# EAGLE schematic Aeternum_V1_0 (EAGLE 9.1.1)

## Sheet 1 of 5
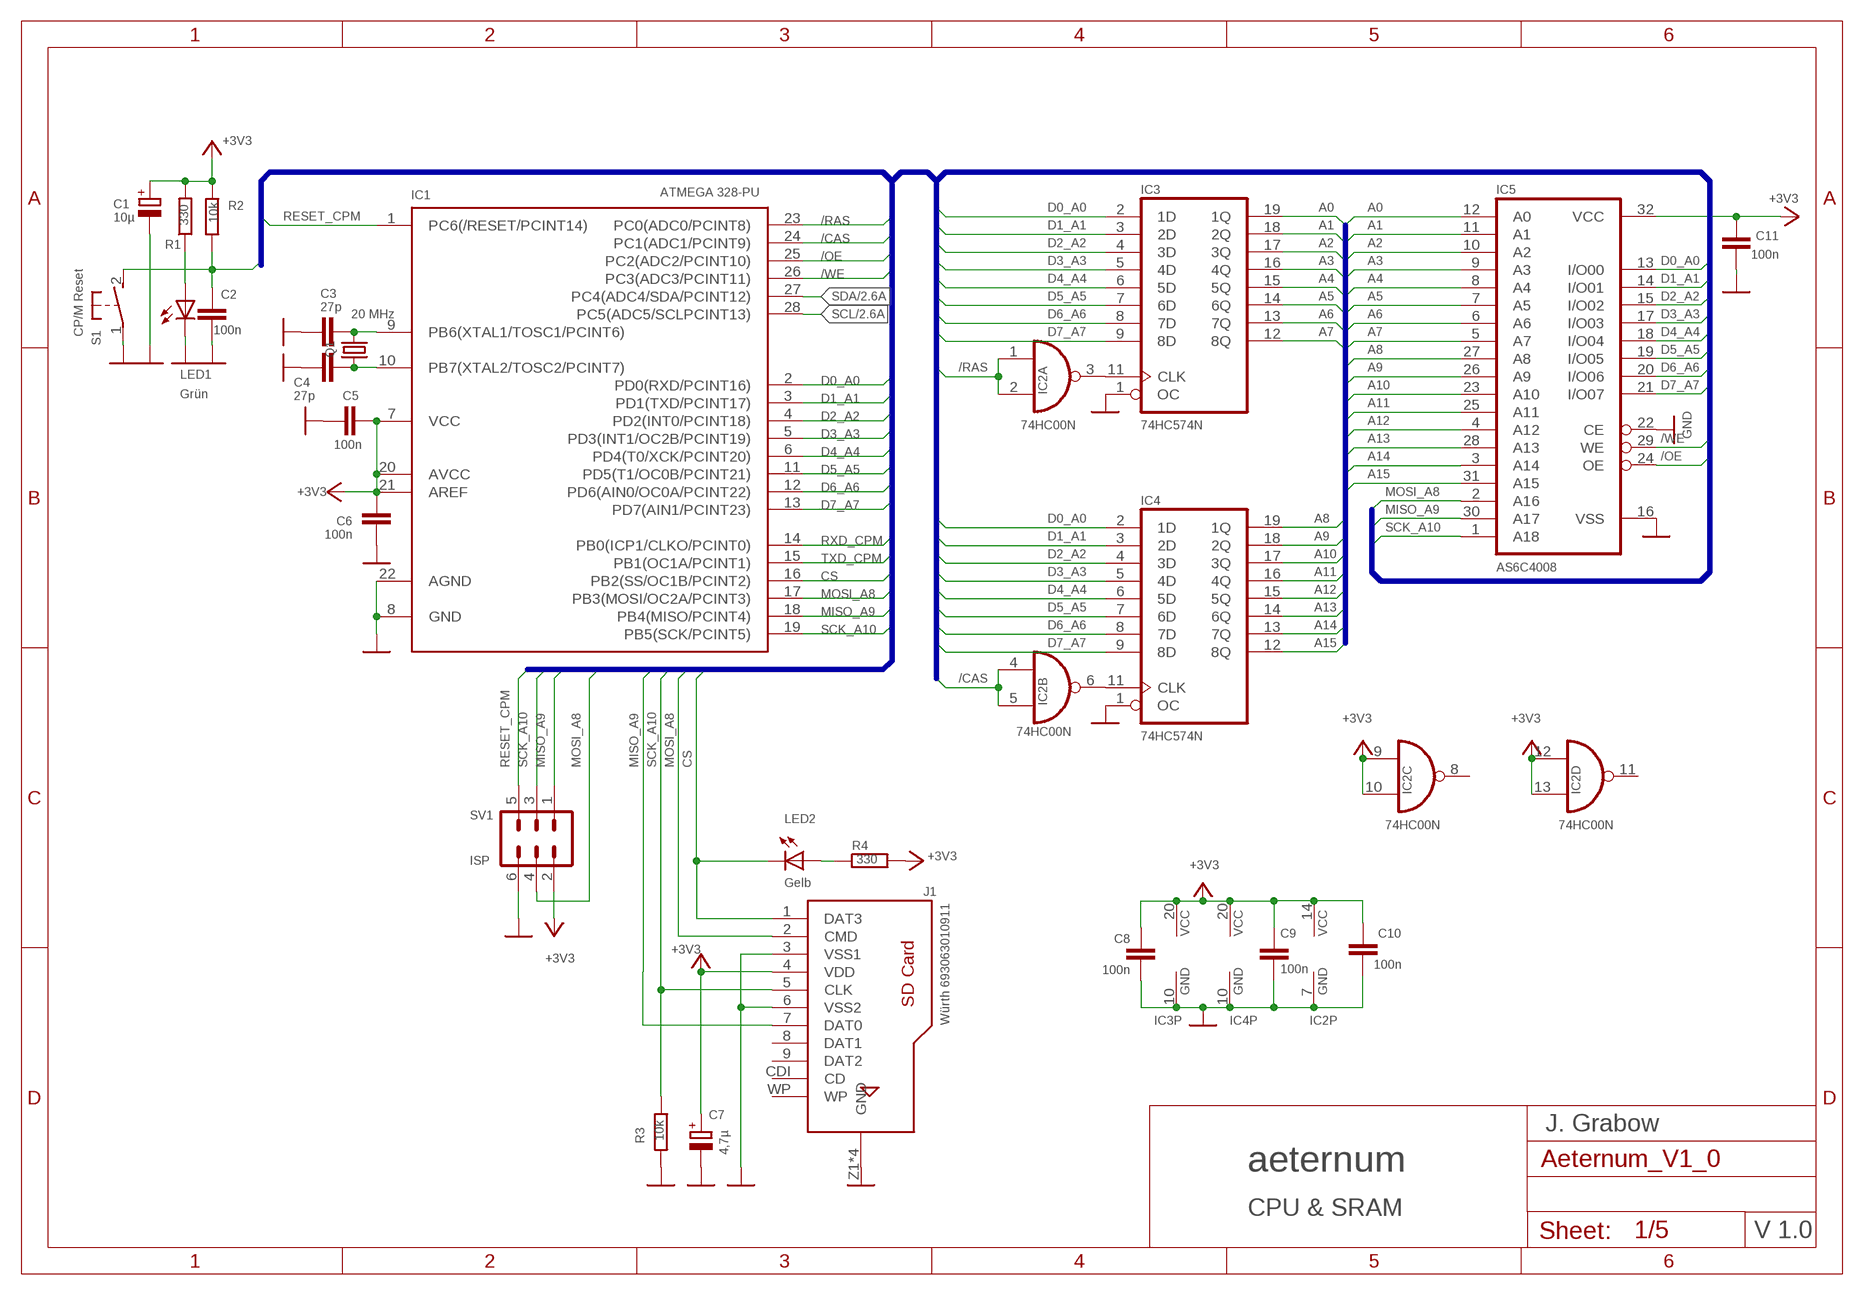
[diagram p0: schematic, sheet 1]

### Parts
C1  10µ  CPOL-EUE2-5  [E2-5]
C2  100n  C-EU025-024X044  [C025-024X044]
C3  27p  C-EU025-024X044  [C025-024X044]
C4  27p  C-EU025-024X044  [C025-024X044]
C5  100n  C-EU025-024X044  [C025-024X044]
C6  100n  C-EU025-024X044  [C025-024X044]
C7  4,7µ  CPOL-EUE2-5  [E2-5]
C8  100n  C-EU025-024X044  [C025-024X044]
C9  100n  C-EU025-024X044  [C025-024X044]
C10  100n  C-EU025-024X044  [C025-024X044]
C11  100n  C-EU025-024X044  [C025-024X044]
IC1  ATMEGA 328-PU  MEGA48/88/168-PU  [DIL28-3]
IC2  74HC00N  [DIL14]
IC3  74HC574N  [DIL20]
IC4  74HC574N  [DIL20]
IC5  AS6C4008  HM628512A_DIL32  [DIL32]
J1  Würth 693063010911  693063010911  [693063010911]
LED1  Grün  LEDCHIPLED_0603  [CHIPLED_0603]
LED2  Gelb  LEDCHIPLED_0603  [CHIPLED_0603]
Q1  20 MHz  CRYSTALHC49S  [HC49/S]
R1  330  R-EU_0204/2V  [0204V]
R2  10k  R-EU_0204/2V  [0204V]
R3  10k  R-EU_0204/2V  [0204V]
R4  330  R-EU_0204/2V  [0204V]
S1  CP/M Reset  31-XX  [B3F-31XX]
SV1  ISP  ML6  [ML6]

### Nets
+3V3: C1.+ C5.1 C6.2 C7.+ C8.1 C9.1 C10.1 C11.1 IC1.7(VCC) IC1.20(AVCC) IC1.21(AREF) IC2.9(C:I0) IC2.10(C:I1) IC2.12(D:I0) IC2.13(D:I1) IC2.14(P:VCC) IC3.20(VCC) IC4.20(VCC) IC5.32(VCC) J1.4(VDD) R1.2 R2.1 R4.2 SV1.2 ; also sheet 2,3,4,5
/CAS: IC1.24(PC1(ADC1/PCINT9)) IC2.4(B:I0) IC2.5(B:I1)
/OE: IC1.25(PC2(ADC2/PCINT10)) IC5.24(OE)
/RAS: IC1.23(PC0(ADC0/PCINT8)) IC2.1(A:I0) IC2.2(A:I1)
/WE: IC1.26(PC3(ADC3/PCINT11)) IC5.29(WE)
A0: IC3.19(1Q) IC5.12(A0)
A1: IC3.18(2Q) IC5.11(A1)
A2: IC3.17(3Q) IC5.10(A2)
A3: IC3.16(4Q) IC5.9(A3)
A4: IC3.15(5Q) IC5.8(A4)
A5: IC3.14(6Q) IC5.7(A5)
A6: IC3.13(7Q) IC5.6(A6)
A7: IC3.12(8Q) IC5.5(A7)
A8: IC4.19(1Q) IC5.27(A8)
A9: IC4.18(2Q) IC5.26(A9)
A10: IC4.17(3Q) IC5.23(A10)
A11: IC4.16(4Q) IC5.25(A11)
A12: IC4.15(5Q) IC5.4(A12)
A13: IC4.14(6Q) IC5.28(A13)
A14: IC4.13(7Q) IC5.3(A14)
A15: IC4.12(8Q) IC5.31(A15)
CS: IC1.16(PB2(SS/OC1B/PCINT2)) J1.1(DAT3) LED2.C
D0_A0: IC1.2(PD0(RXD/PCINT16)) IC3.2(1D) IC4.2(1D) IC5.13(I/O00)
D1_A1: IC1.3(PD1(TXD/PCINT17)) IC3.3(2D) IC4.3(2D) IC5.14(I/O01)
D2_A2: IC1.4(PD2(INT0/PCINT18)) IC3.4(3D) IC4.4(3D) IC5.15(I/O02)
D3_A3: IC1.5(PD3(INT1/OC2B/PCINT19)) IC3.5(4D) IC4.5(4D) IC5.17(I/O03)
D4_A4: IC1.6(PD4(T0/XCK/PCINT20)) IC3.6(5D) IC4.6(5D) IC5.18(I/O04)
D5_A5: IC1.11(PD5(T1/OC0B/PCINT21)) IC3.7(6D) IC4.7(6D) IC5.19(I/O05)
D6_A6: IC1.12(PD6(AIN0/OC0A/PCINT22)) IC3.8(7D) IC4.8(7D) IC5.20(I/O06)
D7_A7: IC1.13(PD7(AIN1/PCINT23)) IC3.9(8D) IC4.9(8D) IC5.21(I/O07)
GND: C1.- C2.1 C3.2 C4.2 C5.2 C6.1 C7.- C8.2 C9.2 C10.2 C11.2 IC1.8(GND) IC1.22(AGND) IC2.7(P:GND) IC3.1(OC) IC3.10(GND) IC4.1(OC) IC4.10(GND) IC5.16(VSS) IC5.22(CE) J1.3(VSS1) J1.6(VSS2) J1.Z1(GND) J1.Z2(GND) J1.Z3(GND) J1.Z4(GND) LED1.C R3.2 S1.1(P) SV1.6 ; also sheet 2,3,4,5
MISO_A9: IC1.18(PB4(MISO/PCINT4)) IC5.30(A17) J1.7(DAT0) SV1.1
MOSI_A8: IC1.17(PB3(MOSI/OC2A/PCINT3)) IC5.2(A16) J1.2(CMD) SV1.4
N$1: C4.1 IC1.10(PB7(XTAL2/TOSC2/PCINT7)) Q1.1
N$5: IC2.3(A:O) IC3.11(CLK)
N$7: LED1.A R1.1
N$13: LED2.A R4.1
N$24: C3.1 IC1.9(PB6(XTAL1/TOSC1/PCINT6)) Q1.2
N$40: IC2.6(B:O) IC4.11(CLK)
RESET_CPM: C2.2 IC1.1(PC6(/RESET/PCINT14)) R2.2 S1.2(S) SV1.5 ; also sheet 5
RXD_CPM: IC1.14(PB0(ICP1/CLKO/PCINT0)) ; also sheet 4
SCK_A10: IC1.19(PB5(SCK/PCINT5)) IC5.1(A18) J1.5(CLK) R3.1 SV1.3
SCL: IC1.28(PC5(ADC5/SCLPCINT13)) ; also sheet 2,3
SDA: IC1.27(PC4(ADC4/SDA/PCINT12)) ; also sheet 2,3
TXD_CPM: IC1.15(PB1(OC1A/PCINT1)) ; also sheet 4
Unconnected: IC2.8(C:O) IC2.11(D:O) J1.8(DAT1) J1.9(DAT2) J1.CDI(CD) J1.WP

### Buses
/CAS,CS,D0_A0,D1_A1,D2_A2,D3_A3,D4_A4,D5_A5,D6_A6,D7_A7,MISO_A9,MOSI_A8,/OE,/RAS,RESET_CPM,RXD,SCK,SCK_A10,TXD,/WE
A0,A1,A2,A3,A4,A5,A6,A7,A8,A9,A10,A11,A12,A13,A14,A15
/CAS,CS,D0_A0,D1_A1,D2_A2,D3_A3,D4_A4,D5_A5,D6_A6,D7_A7,MISO_A9,MOSI_A8,/OE,/RAS,RESET_CPM,RXD_AVR,RXD_CPM,SCK,SCK_A10,TXD_AVR,TXD_CPM,/WE

### Notes on the sheet
- J. Grabow
- aeternum
- CPU & SRAM
- V 1.0

## Sheet 2 of 5
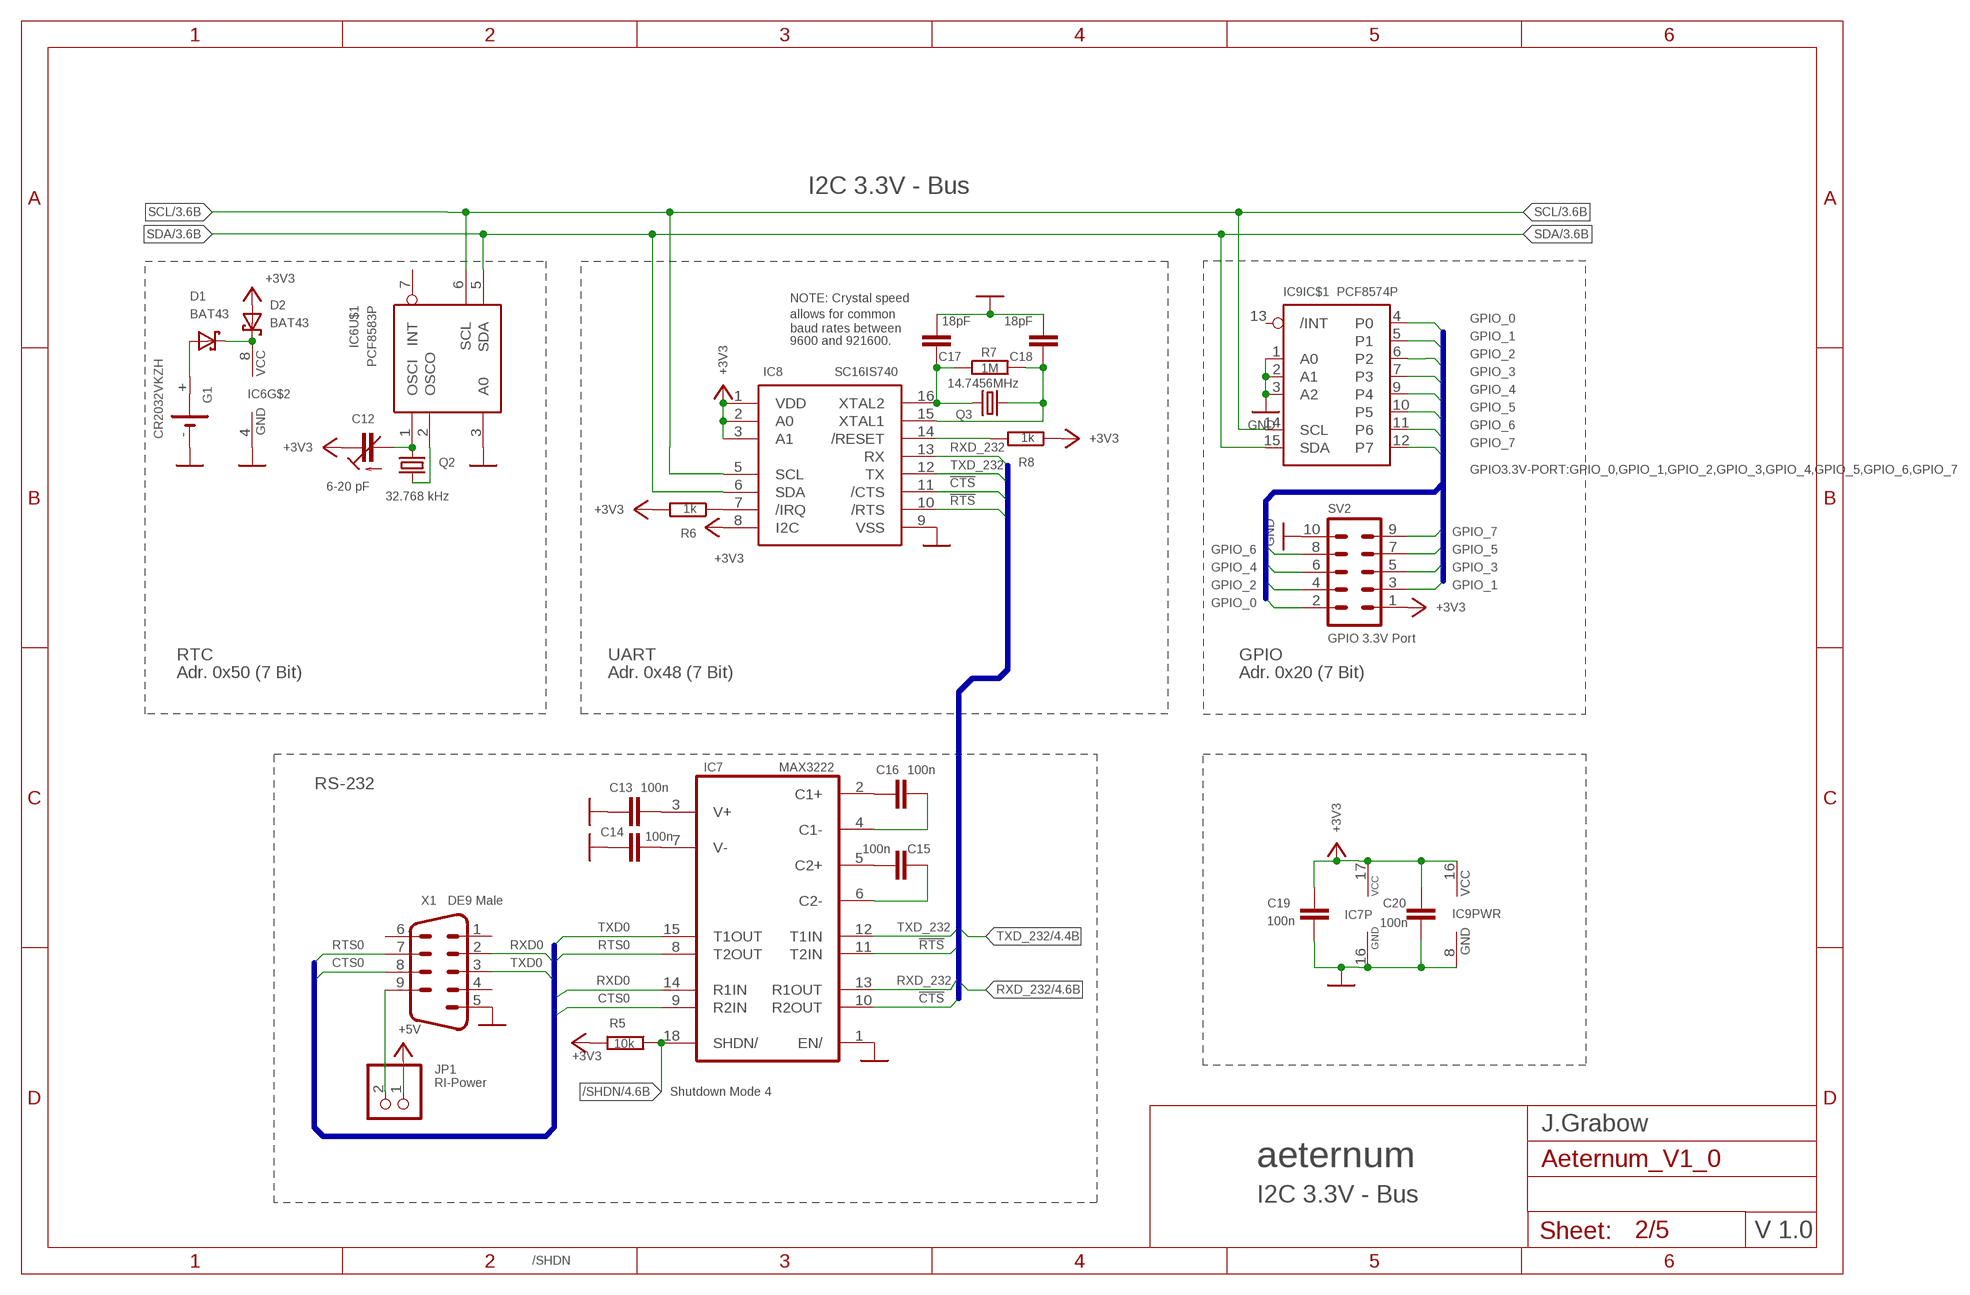
[diagram p1: schematic, sheet 2]

### Parts
C12  6-20 pF  C-TRIMMTZ03  [CTRIMTZ03]
C13  100n  C-EU025-024X044  [C025-024X044]
C14  100n  C-EU025-024X044  [C025-024X044]
C15  100n  C-EU025-024X044  [C025-024X044]
C16  100n  C-EU025-024X044  [C025-024X044]
C17  18pF  CAP0402-CAP  [0402-CAP]
C18  18pF  CAP0402-CAP  [0402-CAP]
C19  100n  C-EU025-024X044  [C025-024X044]
C20  100n  C-EU025-024X044  [C025-024X044]
D1  BAT43  DS_E2L  [E2LINE]
D2  BAT43  DS_E2L  [E2LINE]
G1  CR2032VKZH  [KZH20PCB-V]
IC6  PCF8583P  [DIL08]
IC7  MAX3222  [DIL18]
IC8  SC16IS740  RICKK2_SC16IS740  [RICKK2_SC16IS740]
IC9  PCF8574P  [DIL16]
JP1  RI-Power  PINHD-1X2  [1X02]
Q2  32.768 kHz  CRYSTALTC26H  [TC26H]
Q3  14.7456MHz  CRYSTAL5X3  [CRYSTAL-SMD-5X3]
R5  10k  R-EU_0204/2V  [0204V]
R6  1k  R-EU_R0805  [R0805]
R7  1M  R-EU_R0805  [R0805]
R8  1k  R-EU_R0805  [R0805]
SV2  GPIO 3.3V Port  ML10L  [ML10L]
X1  DE9 Male  M09HP  [M09HP]

### Nets
!CTS: IC7.10(R2OUT) IC8.11(/CTS)
!RTS: IC7.11(T2IN) IC8.10(/RTS)
+3V3: C12.1(E) C19.2 C20.2 D2.2(A) IC7.17(VCC) IC8.1(VDD) IC8.2(A0) IC8.3(A1) IC8.8(I2C) IC9.16(PWR:VCC) R5.2 R6.2 R8.1 SV2.1 ; also sheet 1,3,4,5
+5V: JP1.1 ; also sheet 3,4,5
/SHDN: IC7.18(SHDN/) R5.1 ; also sheet 4
CTS0: IC7.9(R2IN) X1.8
GND: C13.2 C14.2 C17.2 C18.2 C19.1 C20.1 G1.- IC6.3(U$1:A0) IC6.4(GND) IC7.1(EN/) IC7.16(GND) IC8.9(VSS) IC9.1(IC$1:A0) IC9.2(IC$1:A1) IC9.3(IC$1:A2) IC9.8(PWR:GND) SV2.10 X1.5 ; also sheet 1,3,4,5
GPIO_0: IC9.4(IC$1:P0) SV2.2
GPIO_1: IC9.5(IC$1:P1) SV2.3
GPIO_2: IC9.6(IC$1:P2) SV2.4
GPIO_3: IC9.7(IC$1:P3) SV2.5
GPIO_4: IC9.9(IC$1:P4) SV2.6
GPIO_5: IC9.10(IC$1:P5) SV2.7
GPIO_6: IC9.11(IC$1:P6) SV2.8
GPIO_7: IC9.12(IC$1:P7) SV2.9
N$2: C12.2(A) IC6.1(U$1:OSCI) Q2.1
N$4: IC6.2(U$1:OSCO) Q2.2
N$8: C17.1 IC8.16(XTAL2) Q3.3 R7.1
N$9: C16.2 IC7.2(C1+)
N$10: JP1.2 X1.9
N$11: C15.1 IC7.5(C2+)
N$12: C14.1 IC7.7(V-)
N$14: C16.1 IC7.4(C1-)
N$15: C15.2 IC7.6(C2-)
N$17: C13.1 IC7.3(V+)
N$18: D1.1(K) D2.1(K) IC6.8(VCC)
N$19: D1.2(A) G1.+
N$23: C18.1 IC8.15(XTAL1) Q3.1 R7.2
N$49: IC8.14(/RESET) R8.2
N$50: IC8.7(/IRQ) R6.1
RTS0: IC7.8(T2OUT) X1.7
RXD0: IC7.14(R1IN) X1.2
RXD_232: IC7.13(R1OUT) IC8.13(RX) ; also sheet 4
SCL: IC6.6(U$1:SCL) IC8.5(SCL) IC9.14(IC$1:SCL) ; also sheet 1,3
SDA: IC6.5(U$1:SDA) IC8.6(SDA) IC9.15(IC$1:SDA) ; also sheet 1,3
TXD0: IC7.15(T1OUT) X1.3
TXD_232: IC7.12(T1IN) IC8.12(TX) ; also sheet 4
Unconnected: G1.+@1(+) IC6.7(U$1:INT) IC9.13(IC$1:/INT) X1.1 X1.4 X1.6

### Buses
UART:!CTS,!DCD,!DSR,!DTR,!RI,!RTS,RXD_232,TXD_232
GPIO3.3V-PORT:GPIO_0,GPIO_1,GPIO_2,GPIO_3,GPIO_4,GPIO_5,GPIO_6,GPIO_7
CTS0,DCD0,DSR0,DTR0,GND,RI0,RS-232,RTS0,RXD0,TXA0,TXD0,VCC

### Notes on the sheet
- I2C 3.3V - Bus
- NOTE: Crystal speed
- allows for common
- baud rates between
- 9600 and 921600.
- RTC | UART | GPIO
- Adr. 0x50 (7 Bit) | Adr. 0x48 (7 Bit) | Adr. 0x20 (7 Bit)
- RS-232
- Shutdown Mode 4
- J.Grabow
- aeternum
- I2C 3.3V - Bus
- V 1.0

## Sheet 3 of 5
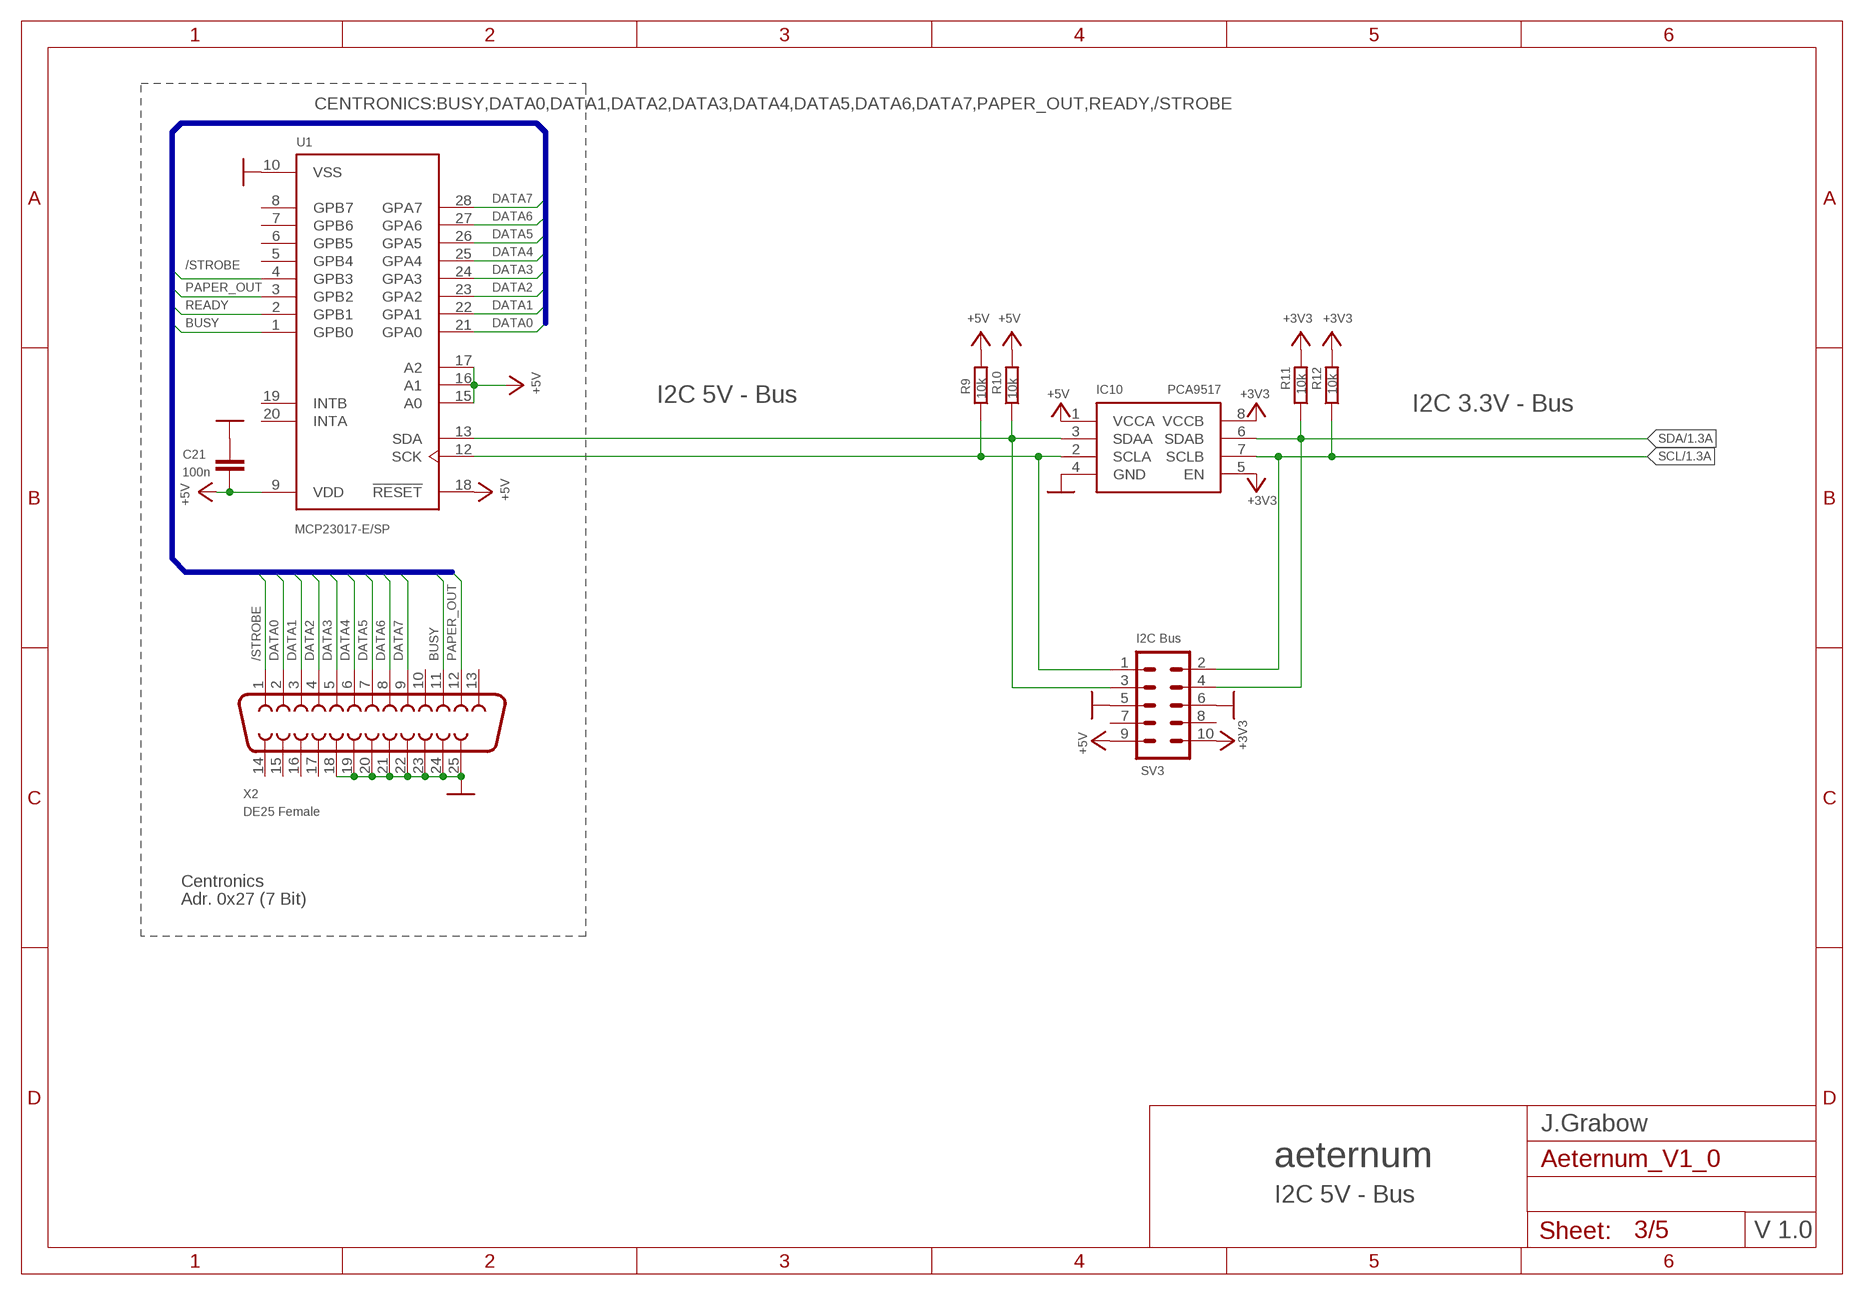
[diagram p2: schematic, sheet 3]

### Parts
C21  100n  C-EUC0805  [C0805]
IC10  PCA9517  [SO-08]
R9  10k  R-EU_0207/2V  [0207/2V]
R10  10k  R-EU_0207/2V  [0207/2V]
R11  10k  R-EU_0207/2V  [0207/2V]
R12  10k  R-EU_0207/2V  [0207/2V]
SV3  I2C Bus  ML10L  [ML10L]
U1  MCP23017-E/SP  [DIP793W45P254L3556H508Q28]
X2  DE25 Female  F25H  [F25H]

### Nets
+3V3: IC10.5(EN) IC10.8(VCCB) R11.2 R12.2 SV3.10 ; also sheet 1,2,4,5
+5V: C21.1 IC10.1(VCCA) R9.2 R10.2 SV3.9 U1.9(VDD) U1.15(A0) U1.16(A1) U1.17(A2) U1.18(!RESET) ; also sheet 2,4,5
/STROBE: U1.4(GPB3) X2.1
BUSY: U1.1(GPB0) X2.11
DATA0: U1.21(GPA0) X2.2
DATA1: U1.22(GPA1) X2.3
DATA2: U1.23(GPA2) X2.4
DATA3: U1.24(GPA3) X2.5
DATA4: U1.25(GPA4) X2.6
DATA5: U1.26(GPA5) X2.7
DATA6: U1.27(GPA6) X2.8
DATA7: U1.28(GPA7) X2.9
GND: C21.2 IC10.4(GND) SV3.5 SV3.6 U1.10(VSS) X2.18 X2.19 X2.20 X2.21 X2.22 X2.23 X2.24 X2.25 ; also sheet 1,2,4,5
PAPER_OUT: U1.3(GPB2) X2.12
READY: U1.2(GPB1)
SCL: IC10.7(SCLB) R12.1 SV3.2 ; also sheet 1,2
SCLA: IC10.2(SCLA) R9.1 SV3.1 U1.12(SCK)
SDA: IC10.6(SDAB) R11.1 SV3.4 ; also sheet 1,2
SDAA: IC10.3(SDAA) R10.1 SV3.3 U1.13(SDA)
Unconnected: SV3.7 SV3.8 U1.5(GPB4) U1.6(GPB5) U1.7(GPB6) U1.8(GPB7) U1.19(INTB) U1.20(INTA) X2.10 X2.13 X2.14 X2.15 X2.16 X2.17

### Buses
CENTRONICS:BUSY,DATA0,DATA1,DATA2,DATA3,DATA4,DATA5,DATA6,DATA7,PAPER_OUT,READY,/STROBE

### Notes on the sheet
- I2C 5V - Bus
- I2C 3.3V - Bus
- Centronics
- Adr. 0x27 (7 Bit)
- J.Grabow
- aeternum
- I2C 5V - Bus
- V 1.0

## Sheet 4 of 5
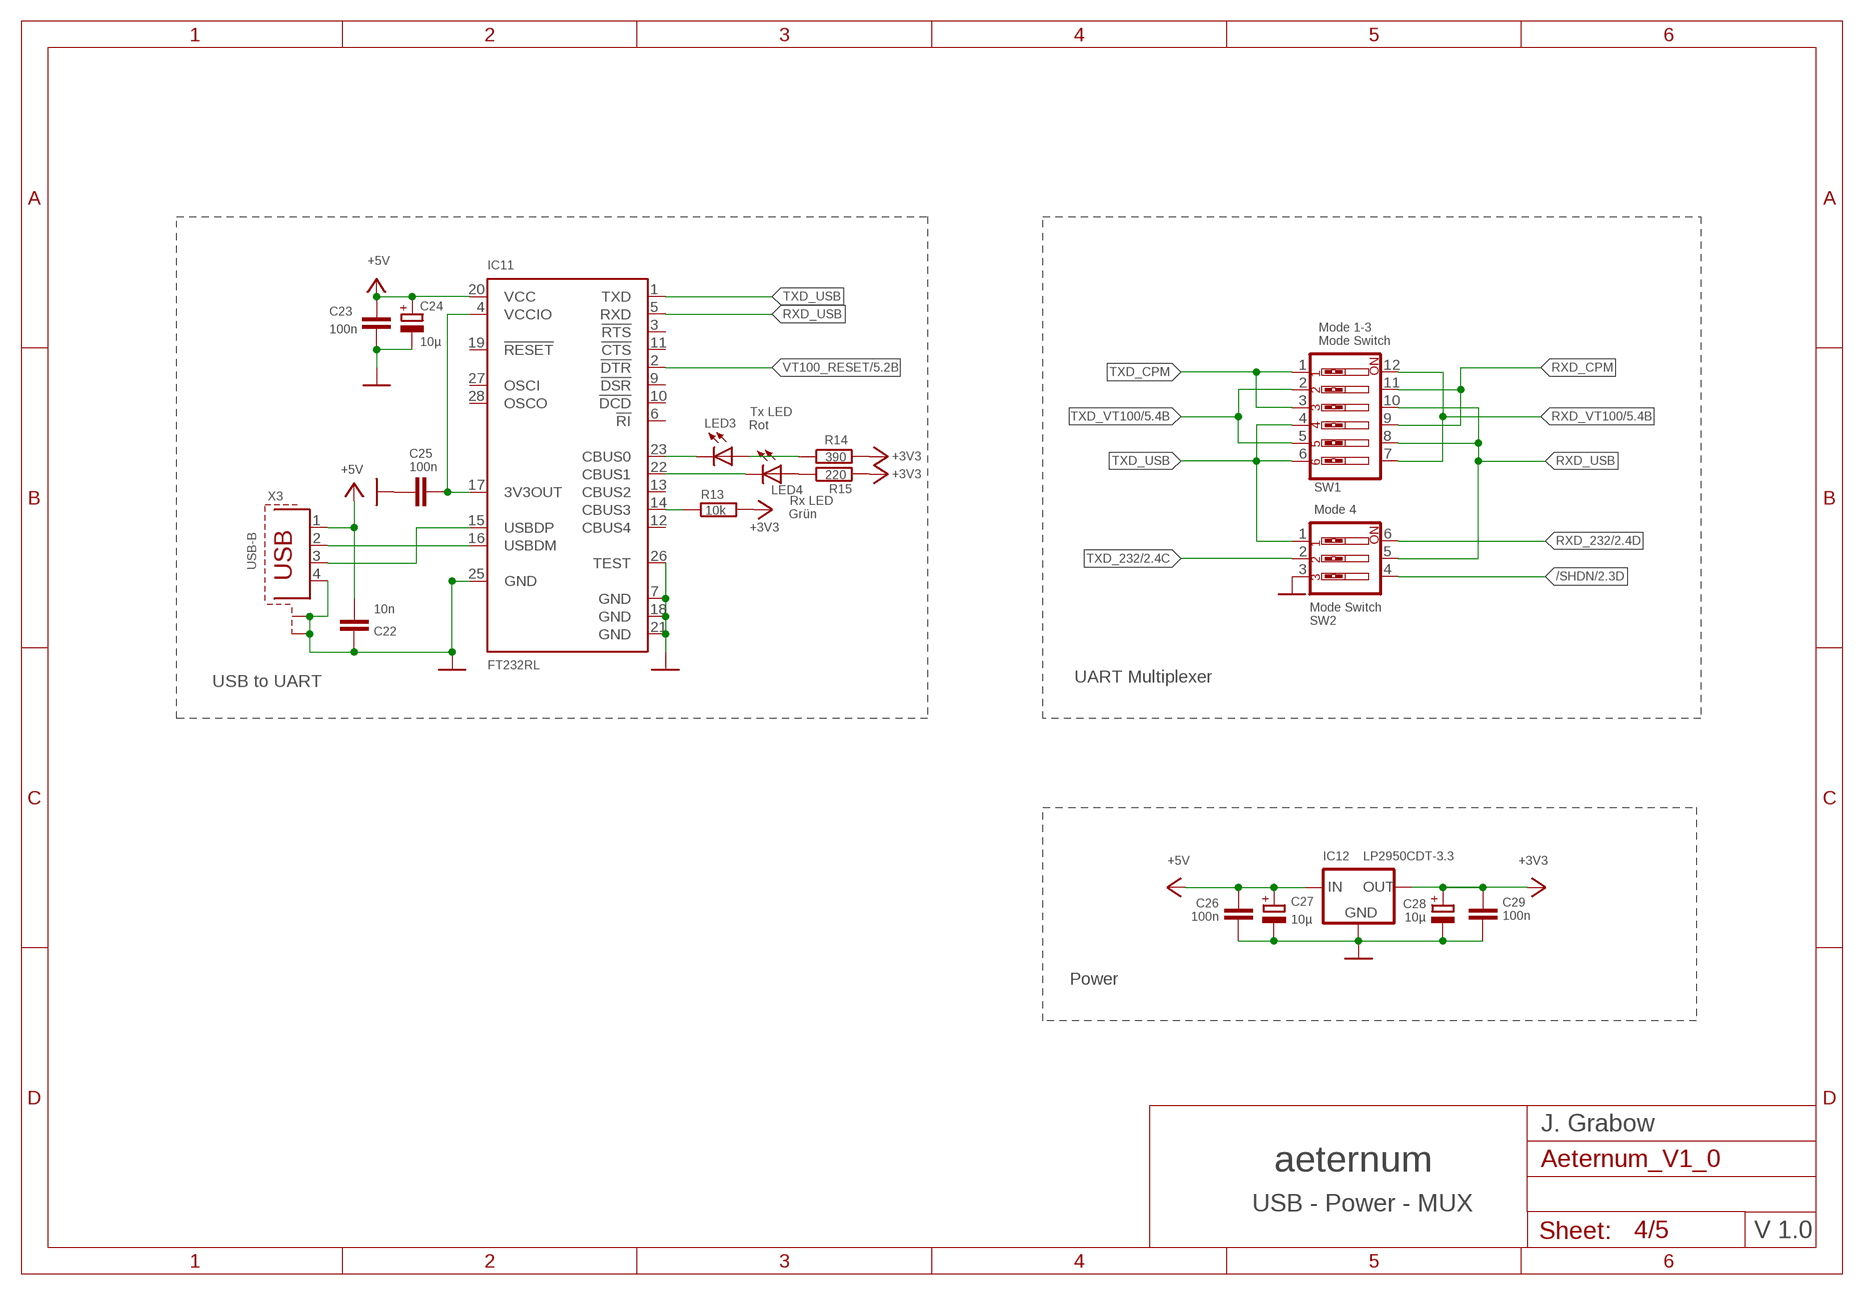
[diagram p3: schematic, sheet 4]

### Parts
C22  10n  C-EU025-024X044  [C025-024X044]
C23  100n  C-EU025-024X044  [C025-024X044]
C24  10µ  CPOL-EUE2-5  [E2-5]
C25  100n  C-EU025-024X044  [C025-024X044]
C26  100n  C-EU025-024X044  [C025-024X044]
C27  10µ  CPOL-EUE2-5  [E2-5]
C28  10µ  CPOL-EUE2-5  [E2-5]
C29  100n  C-EU025-024X044  [C025-024X044]
IC11  FT232RL  [SSOP28]
IC12  LP2950CDT-3.3  [DPACK]
LED3  Rot  LEDCHIPLED_0603  [CHIPLED_0603]
LED4  Grün  LEDCHIPLED_0603  [CHIPLED_0603]
R13  10k  R-EU_0204/2V  [0204V]
R14  390  R-EU_0204/2V  [0204V]
R15  220  R-EU_0204/2V  [0204V]
SW1  Mode Switch  SW_DIP-6  [EDG-06]
SW2  Mode Switch  SW_DIP-3  [EDG-03]
X3  USB-B  PN61729-S  [PN61729-S]

### Nets
+3V3: C28.+ C29.2 IC12.3(OUT) R13.2 R14.2 R15.2 ; also sheet 1,2,3,5
+5V: C22.2 C23.2 C24.+ C26.2 C27.+ IC11.20(VCC) IC12.1(IN) X3.1 ; supply symbol labelled 5V USB ; also sheet 2,3,5
/SHDN: SW2.4 ; also sheet 2
GND: C22.1 C23.1 C24.- C25.1 C26.1 C27.- C28.- C29.1 IC11.7(GND) IC11.18(GND) IC11.21(GND) IC11.25(GND) IC11.26(TEST) IC12.4(GND) SW2.3 X3.4 X3.S1 X3.S2 ; also sheet 1,2,3,5
N$3: IC11.16(USBDM) X3.2
N$6: IC11.15(USBDP) X3.3
N$16: IC11.14(CBUS3) R13.1
N$32: C25.2 IC11.4(VCCIO) IC11.17(3V3OUT)
N$43: IC11.23(CBUS0) LED3.C
N$44: IC11.22(CBUS1) LED4.C
N$45: LED4.A R15.1
N$46: LED3.A R14.1
RXD_232: SW2.6 ; also sheet 2
RXD_CPM: SW1.9 SW1.11 ; also sheet 1
RXD_USB: IC11.5(RXD) SW1.8 SW1.10 SW2.5
RXD_VT100: SW1.7 SW1.12 ; also sheet 5
TXD_232: SW2.2 ; also sheet 2
TXD_CPM: SW1.1 SW1.3 ; also sheet 1
TXD_USB: IC11.1(TXD) SW1.4 SW1.6 SW2.1
TXD_VT100: SW1.2 SW1.5 ; also sheet 5
VT100_RESET: IC11.2(!DTR) ; also sheet 5
Unconnected: IC11.3(!RTS) IC11.6(!RI) IC11.9(!DSR) IC11.10(!DCD) IC11.11(!CTS) IC11.12(CBUS4) IC11.13(CBUS2) IC11.19(!RESET) IC11.27(OSCI) IC11.28(OSCO)

### Notes on the sheet
- Mode 1-3
- Tx LED
- Rx LED
- Mode 4
- USB to UART | UART Multiplexer
- Power
- J. Grabow
- aeternum
- USB - Power - MUX
- V 1.0

## Sheet 5 of 5
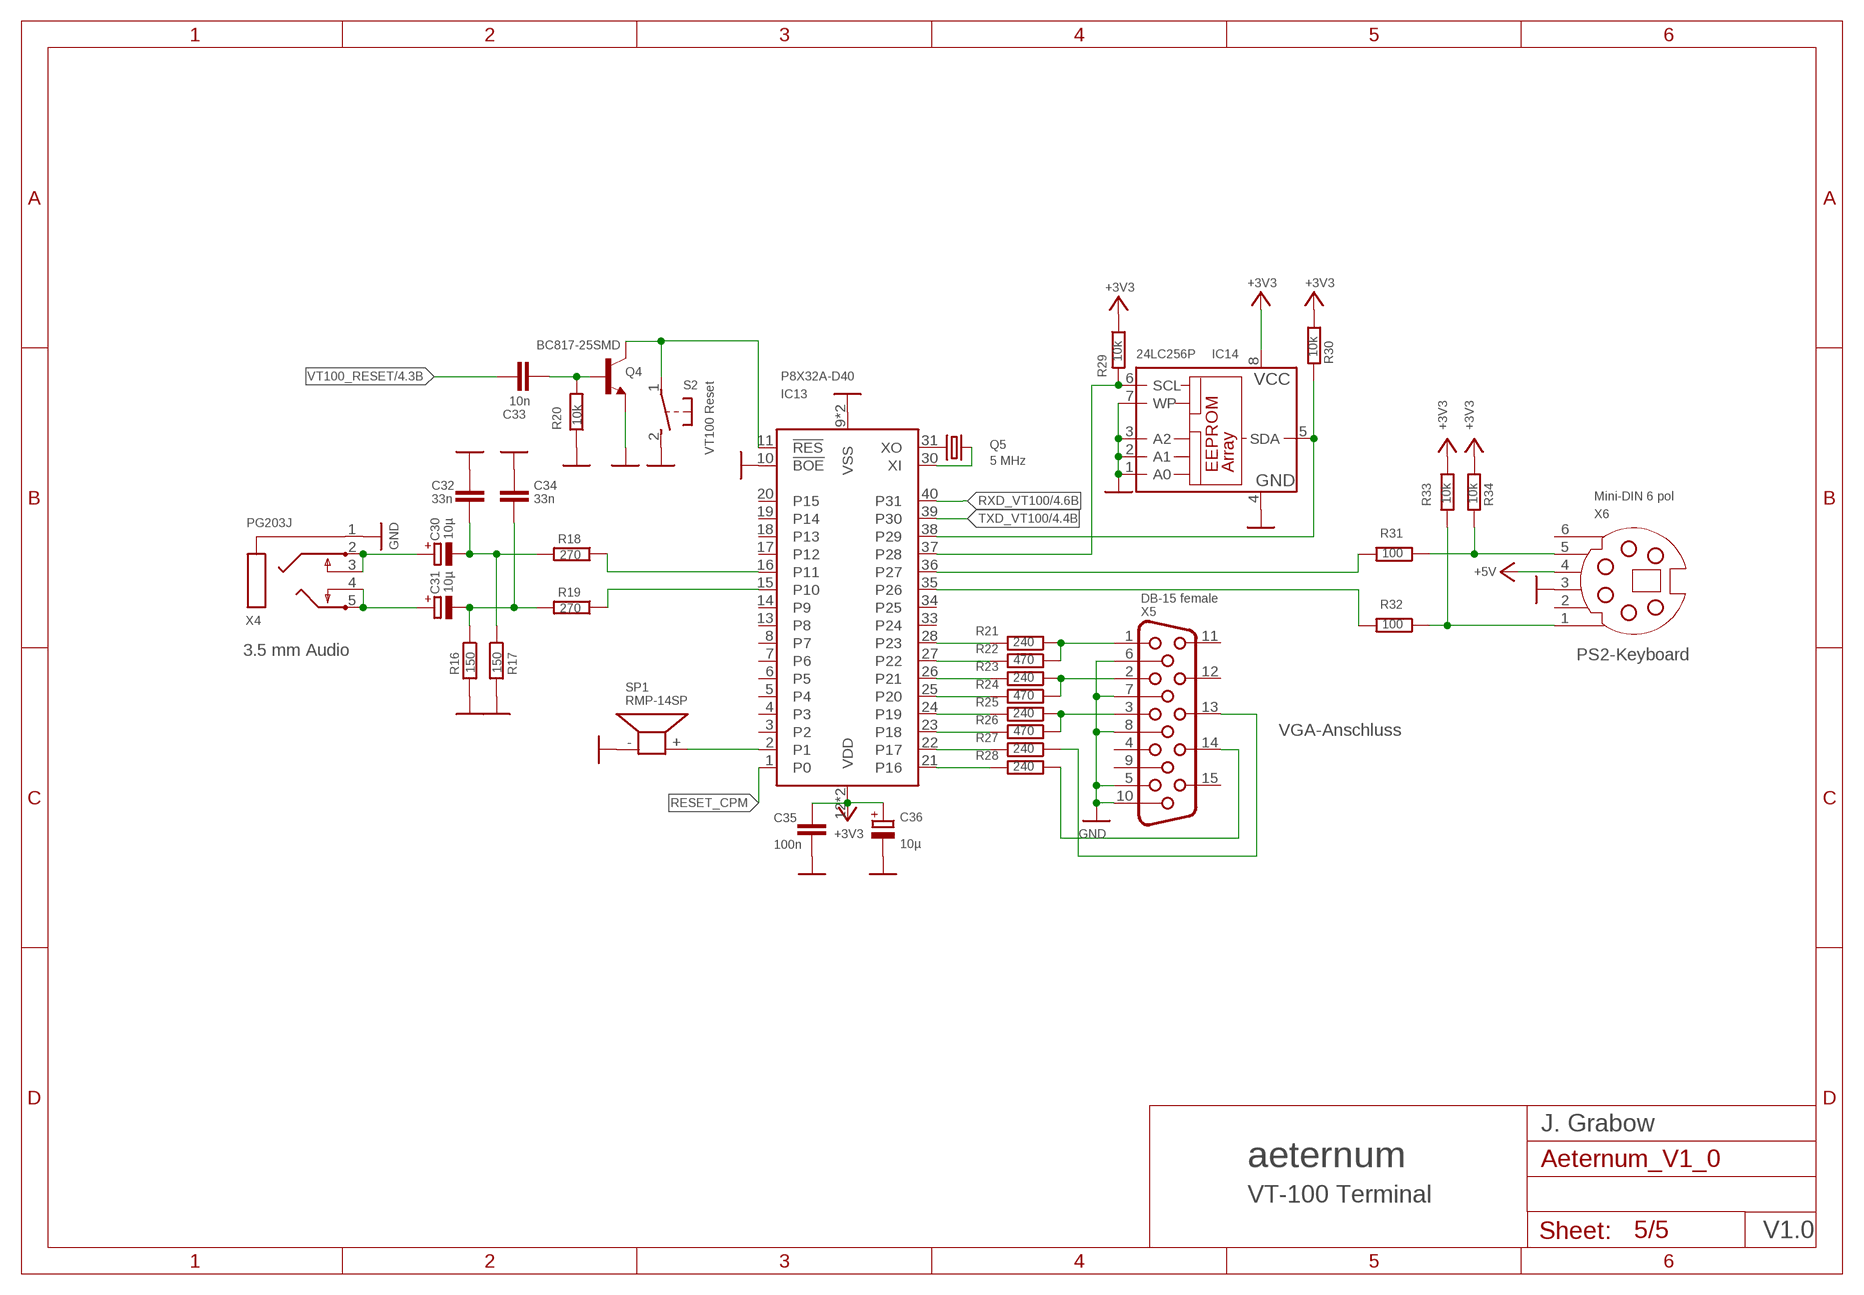
[diagram p4: schematic, sheet 5]

### Parts
C30  10µ  CPOL-EUE2.5-5  [E2,5-5]
C31  10µ  CPOL-EUE2.5-5  [E2,5-5]
C32  33n  C-EU025-024X044  [C025-024X044]
C33  10n  C-EU025-024X044  [C025-024X044]
C34  33n  C-EU025-024X044  [C025-024X044]
C35  100n  C-EU025-024X044  [C025-024X044]
C36  10µ  CPOL-EUE2,5-6E  [E2,5-6E]
IC13  P8X32A-D40  [DIL40]
IC14  24LC256P  [DIL8]
Q4  BC817-25SMD  [SOT23-BEC]
Q5  5 MHz  CRYSTALHC49S  [HC49/S]
R16  150  R-EU_0204/2V  [0204V]
R17  150  R-EU_0204/2V  [0204V]
R18  270  R-EU_0204/2V  [0204V]
R19  270  R-EU_0204/2V  [0204V]
R20  10k  R-EU_0204/2V  [0204V]
R21  240  R-EU_0204/2V  [0204V]
R22  470  R-EU_0204/2V  [0204V]
R23  240  R-EU_0204/2V  [0204V]
R24  470  R-EU_0204/2V  [0204V]
R25  240  R-EU_0204/2V  [0204V]
R26  470  R-EU_0204/2V  [0204V]
R27  240  R-EU_0204/2V  [0204V]
R28  240  R-EU_0204/2V  [0204V]
R29  10k  R-EU_0204/7  [0204/7]
R30  10k  R-EU_0204/7  [0204/7]
R31  100  R-EU_0204/2V  [0204V]
R32  100  R-EU_0204/2V  [0204V]
R33  10k  R-EU_0204/2V  [0204V]
R34  10k  R-EU_0204/2V  [0204V]
S2  VT100 Reset  31-XX  [B3F-31XX]
SP1  RMP-14SP  KSS1201  [KSS1201]
X4  PG203J  [PG203J]
X5  DB-15 female  HF15H  [HDF15H]
X6  Mini-DIN 6 pol  MDSSV-BC06  [SSV-BC06]

### Nets
+3V3: C35.2 C36.+ IC13.12(VDD) IC13.32(VDD) IC14.8(VCC) R29.1 R30.1 R33.1 R34.1 ; also sheet 1,2,3,4
+5V: X6.4 ; also sheet 2,3,4
GND: C32.2 C34.2 C35.1 C36.- IC13.9(VSS) IC13.10(!BOE) IC13.29(VSS) IC14.1(A0) IC14.2(A1) IC14.3(A2) IC14.4(GND) IC14.7(WP) Q4.E R16.2 R17.2 R20.1 S2.2(S) SP1.- X4.1 X5.5 X5.6 X5.7 X5.8 X5.10 X6.3 ; also sheet 1,2,3,4
N$20: IC13.30(XI) Q5.1
N$21: R21.1 R22.1 X5.1
N$22: IC13.28(P23) R21.2
N$25: IC13.27(P22) R22.2
N$26: R23.1 R24.1 X5.2
N$27: IC13.26(P21) R23.2
N$28: IC13.25(P20) R24.2
N$29: R25.1 R26.1 X5.3
N$30: IC13.24(P19) R25.2
N$31: IC13.23(P18) R26.2
N$33: IC13.22(P17) R27.2
N$34: IC13.21(P16) R28.2
N$35: R27.1 X5.13
N$36: R28.1 X5.14
N$37: R32.1 R33.2 X6.1
N$38: R31.1 R34.2 X6.5
N$39: IC13.31(XO) Q5.2
N$41: IC13.2(P1) SP1.+
N$42: C33.2 Q4.B R20.2
N$47: IC13.37(P28) IC14.6(SCL) R29.2
N$48: IC13.38(P29) IC14.5(SDA) R30.2
N$62: C31.- C34.1 R16.1 R19.2
N$63: C30.- C32.1 R17.1 R18.2
N$64: C30.+ X4.2 X4.3
N$65: C31.+ X4.4 X4.5
P10: IC13.16(P11) R18.1
P11: IC13.15(P10) R19.1
P26: IC13.35(P26) R32.2
P27: IC13.36(P27) R31.2
PROP_RESET: IC13.11(!RES) Q4.C S2.1(P)
RESET_CPM: IC13.1(P0) ; also sheet 1
RXD_VT100: IC13.40(P31) ; also sheet 4
TXD_VT100: IC13.39(P30) ; also sheet 4
VT100_RESET: C33.1 ; also sheet 4
Unconnected: IC13.3(P2) IC13.4(P3) IC13.5(P4) IC13.6(P5) IC13.7(P6) IC13.8(P7) IC13.13(P8) IC13.14(P9) IC13.17(P12) IC13.18(P13) IC13.19(P14) IC13.20(P15) IC13.33(P24) IC13.34(P25) X5.4 X5.9 X5.11 X5.12 X5.15 X6.2 X6.6

### Notes on the sheet
- 3.5 mm Audio | PS2-Keyboard
- VGA-Anschluss
- J. Grabow
- aeternum
- VT-100 Terminal
- V1.0

## Library data of the parts
C1 C7 C24 C27 C28 C30 C31 C36 = rcl:CPOL-EU: POLARIZED CAPACITOR, European symbol
C2-C6 C8-C11 C13-C16 C19-C23 C25 C26 C29 C32-C35 = rcl:C-EU: CAPACITOR, European symbol
C12 = rcl:C-TRIMM: Trimm capacitor
C17 C18 = SparkFun:CAP: Capacitor Standard 0603 ceramic capacitor, and 0.1" leaded capacitor.
D1 D2 = zetex:DS_E2L: SHOTTKY DIODE; OC_FARNELL: unknown; OC_NEWARK: unknown
G1 = battery:CR2032V: LI BATTERY Varta
IC1 = avr-7:MEGA48/88/168-PU
IC2 = 74xx-eu:74*00: Quad 2-input NAND gate
IC3 IC4 = 74xx-eu:74*574: 8-bit D type FLIP FLOP bus driver
IC5 = hitachi_sram_hm628512a-series_rev1:HM628512A_DIL32: 4M SRAM 512kword x 8bit
IC6 = i2c_new:PCF8583: Clock/calendar with 240 x 8-bit RAM
IC7 = maxim:MAX3222: RS232 TRANSCEIVER; MPN: MAX3222EPN+; OC_FARNELL: 1188044; OC_NEWARK: 99K3237
IC8 = SC16IS740v4:RICKK2_SC16IS740
IC9 = i2c_new:PCF8574: Remote 8-Bit I/O Expander for I²C Bus
IC10 = PCA9517:PCA9517
IC11 = ftdichip:FT232R: Source: http://www.ftdichip.com/Documents/DataSheets/DS_FT232R_v104.pdf; MPN: FT232RL; OC_FARNELL: 1146032; OC_NEWARK: 91K9918; SPICEPREFIX: X
IC12 = v-reg:LP2950?*: Source: http://cache.national.com/ds/LP/LP2950.pdf
IC13 = p8x32a_11:P8X32A-?: 8-Cog Multiprocessor Microcontroller Source: http://www.parallax.com/sites/default/files/downloads/P8X32A-Propeller-Datasheet-v1.4.0_0.pdf; MF: Parallax Semiconductor; MPN: P8X32A-D40; OC_FARNELL: 1263886; OC_NEWARK: 11X5686
IC14 = microchip:24*: Serial EEPROM I2C; MF: MICROCHIP; MPN: 24LC256-E/P; OC_FARNELL: 9757970; OC_NEWARK: 92C7169
J1 = InputOutputIO (rev18a):693063010911: WR-CRD SD CARD CONNECTOR PUSH & PULL WITH CARD DETECTION 9PINS=>Code : Con_I-O_COM_CRD_SD_Normal_693063010911 <http://katalog.we-online.de/media/images/eican/Con_I-O_COM_CRD_SD_Normal_693063010911_pf2.jpg> Details see: http://katalog.we-online.de/en/em/CRD_SD_PUSH_AND_PULL_CRD_DETETCION_9_PINS/693063010911 Created 2014-07-09, Karrer Zheng 2014 (C) Würth Elektronik
JP1 = pinhead:PINHD-1X2: PIN HEADER
LED1-LED4 = led:LED: LED OSRAM: - CHIPLED LG R971, LG N971, LY N971, LG Q971, LY Q971, LO R971, LY R971 LH N974, LH R974 LS Q976, LO Q976, LY Q976 LO Q996 - Hyper CHIPLED LW Q18S LB Q993, LB Q99A, LB R99A - SideLED LS A670, LO A670, LY A670, LG A670, LP A670 LB A673, LV A673, LT A673, LW A673 LH A674 LY A675 LS A676, LA A676, LO A676, LY A676, LW A676 LS A679, LY A679, LG A679 - Hyper Micro SIDELED® LS Y876, LA Y876, LO Y876, LY Y876 LT Y87S - SmartLED LW L88C, LW L88S LB L89C, LB L89S, LG L890 LS L89K, LO L89K, LY L89K LS L896, LA L896, LO L896, LY L896 - TOPLED LS T670, LO T670, LY T670, LG T670, LP T670 LSG T670, LSP T670, LSY T670, LOP T670, LYG T670 LG T671, LOG T671, LSG T671 LB T673, LV T673, LT T673, LW T673 LH T674 LS T676, LA T676, LO T676, LY T676, LB T676, LH T676, LSB T676, LW T676 LB T67C, LV T67C, LT T67C, LS T67K, LO T67K, LY T67K, LW E67C LS E67B, LA E67B, LO E67B, LY E67B, LB E67C, LV E67C, LT E67C LW T67C LS T679, LY T679, LG T679 LS T770, LO T770, LY T770, LG T770, LP T770 LB T773, LV T773, LT T773, LW T773 LH T774 LS E675, LA E675, LY E675, LS T675 LS T776, LA T776, LO T776, LY T776, LB T776 LHGB T686 LT T68C, LB T68C - Hyper Mini TOPLED® LB M676 - Mini TOPLED Santana® LG M470 LS M47K, LO M47K, LY M47K Source: http://www.osram.convergy.de LUXEON: - LUMILED® LXK2-PW12-R00, LXK2-PW12-S00, LXK2-PW14-U00, LXK2-PW14-V00 LXK2-PM12-R00, LXK2-PM12-S00, LXK2-PM14-U00 LXK2-PE12-Q00, LXK2-PE12-R00, LXK2-PE12-S00, LXK2-PE14-T00, LXK2-PE14-U00 LXK2-PB12-K00, LXK2-PB12-L00, LXK2-PB12-M00, LXK2-PB14-N00, LXK2-PB14-P00, LXK2-PB14-Q00 LXK2-PR12-L00, LXK2-PR12-M00, LXK2-PR14-Q00, LXK2-PR14-R00 LXK2-PD12-Q00, LXK2-PD12-R00, LXK2-PD12-S00 LXK2-PH12-R00, LXK2-PH12-S00 LXK2-PL12-P00, LXK2-PL12-Q00, LXK2-PL12-R00 Source: www.luxeon.com KINGBRIGHT: KA-3528ASYC Source: www.kingbright.com
Q1 Q5 = crystal:CRYSTAL: CRYSTAL; OC_FARNELL: 1667008; OC_NEWARK: unknown
Q2 = crystal:CRYSTAL: CRYSTAL; OC_FARNELL: unknown; OC_NEWARK: unknown
Q3 = SparkFun:CRYSTAL: Crystals Various standard crystals. Proven footprints. Spark Fun Electronics SKU : COM-00534
Q4 = transistor-npn:BC817*: NPN Transistor
R1-R34 = rcl:R-EU_: RESISTOR, European symbol
S1 S2 = switch-omron:31-XX: OMRON SWITCH; MPN: B3F-3100; OC_FARNELL: 959704; OC_NEWARK: 36M3582
SP1 = buzzer:KSS1201: SPEAKER Source: Schukat
SV1 = con-harting-ml:ML6: HARTING; OC_FARNELL: unknown; OC_NEWARK: unknown
SV2 SV3 = con-harting-ml:ML10: HARTING; OC_FARNELL: unknown; OC_NEWARK: unknown
SW1 = special:SW_DIP-6: DIP SWITCH
SW2 = special:SW_DIP-3: DIP SWITCH
U1 = I2C_AMESYS:MCP23017-E/SP: IC I/O EXPANDER I2C 16B 28SDIP; AVAILABILITY: Unavailable; DESCRIPTION: MCP23017 Series 5.5 V 1.7 MHz SMT 16-Bit I2C I/O Expander - SPDIP-28; MF: Microchip; MP: MCP23017-E/SP; PACKAGE: DIP-28 Microchip; PRICE: None
X1 = con-subd:M09: SUB-D; OC_FARNELL: unknown; OC_NEWARK: unknown
X2 = con-subd:F25: SUB-D; OC_FARNELL: unknown; OC_NEWARK: unknown
X3 = con-berg:PN61729-S: BERG USB connector; OC_FARNELL: unknown; OC_NEWARK: unknown
X4 = con-hirschmann:PG203J: MIC/HEADPHONE JACK KS-S stereo microphone/headphone jack PG203JN (Schukat); OC_FARNELL: unknown; OC_NEWARK: unknown
X5 = con-subd:HF15: SUB-D; OC_FARNELL: unknown; OC_NEWARK: unknown
X6 = con-yamaichi:MDSSV-BC06: YAMAICHI CONNECTOR; OC_FARNELL: unknown; OC_NEWARK: unknown